# EAGLE schematic Relay (EAGLE 7.6.0)
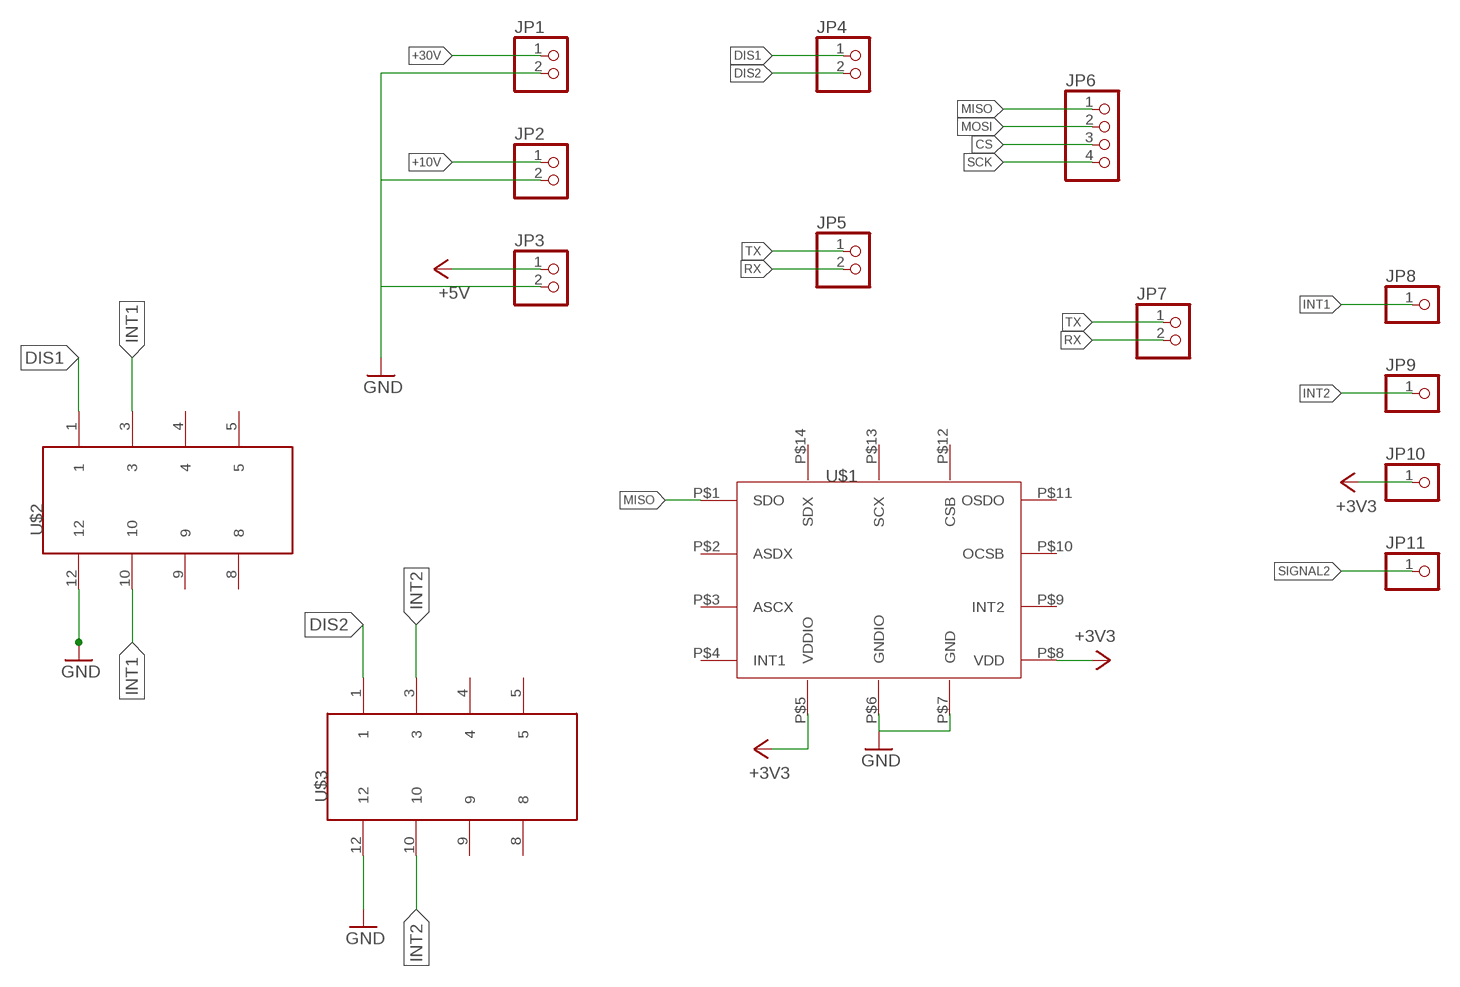
[diagram p0: schematic, sheet 1]

## Parts
JP1  PINHD-1X2  [1X02]
JP2  PINHD-1X2  [1X02]
JP3  PINHD-1X2  [1X02]
JP4  PINHD-1X2  [1X02]
JP5  PINHD-1X2  [1X02]
JP6  PINHD-1X4  [1X04]
JP7  PINHD-1X2  [1X02]
JP8  PINHD-1X1  [1X01]
JP9  PINHD-1X1  [1X01]
JP10  PINHD-1X1  [1X01]
JP11  PINHD-1X1  [1X01]
U$1  BMI160  [IMU]
U$2  EC2  [EC2-5SNU]
U$3  EC2  [EC2-5SNU]

## Nets
+3V3: JP10.1 U$1.P$8(VDD)
+5V: JP3.1
+10V: JP2.1
+30V: JP1.1
CS: JP6.3
DIS1: JP4.1 U$2.1
DIS2: JP4.2 U$3.1
GND: JP1.2 JP2.2 JP3.2 U$2.12 U$3.12
INT1: JP8.1 U$2.3 U$2.10
INT2: JP9.1 U$3.3 U$3.10
MISO: JP6.1 U$1.P$1(SDO)
MOSI: JP6.2
RX: JP5.2 JP7.2
SCK: JP6.4
SIGNAL2: JP11.1
TX: JP5.1 JP7.1
Unconnected: U$1.P$2(ASDX) U$1.P$3(ASCX) U$1.P$4(INT1) U$1.P$5(VDDIO) U$1.P$9(INT2) U$1.P$10(OCSB) U$1.P$11(OSDO) U$1.P$12(CSB) U$1.P$13(SCX) U$1.P$14(SDX) U$2.4 U$2.5 U$2.8 U$2.9 U$3.4 U$3.5 U$3.8 U$3.9

## Power pins joined to a net without a drawn wire
GND: U$1.P$7(GND)
GNDIO: U$1.P$6(GNDIO)

## Library data of the parts
JP1-JP5 JP7 = pinhead:PINHD-1X2: PIN HEADER
JP6 = pinhead:PINHD-1X4: PIN HEADER
JP8-JP11 = pinhead:PINHD-1X1: PIN HEADER
U$1 = IMU:BMI160
U$2 U$3 = relay board:EC2: EC2 is miniature signal relay Minimal board space is consumed with either a through-hole or surface mount configuration. Datasheet https://content.kemet.com/datasheets/KEM_R7002_EC2_EE2.pdf